# Altium schematic sheet nfc-epd-sensors.SchDoc
size A
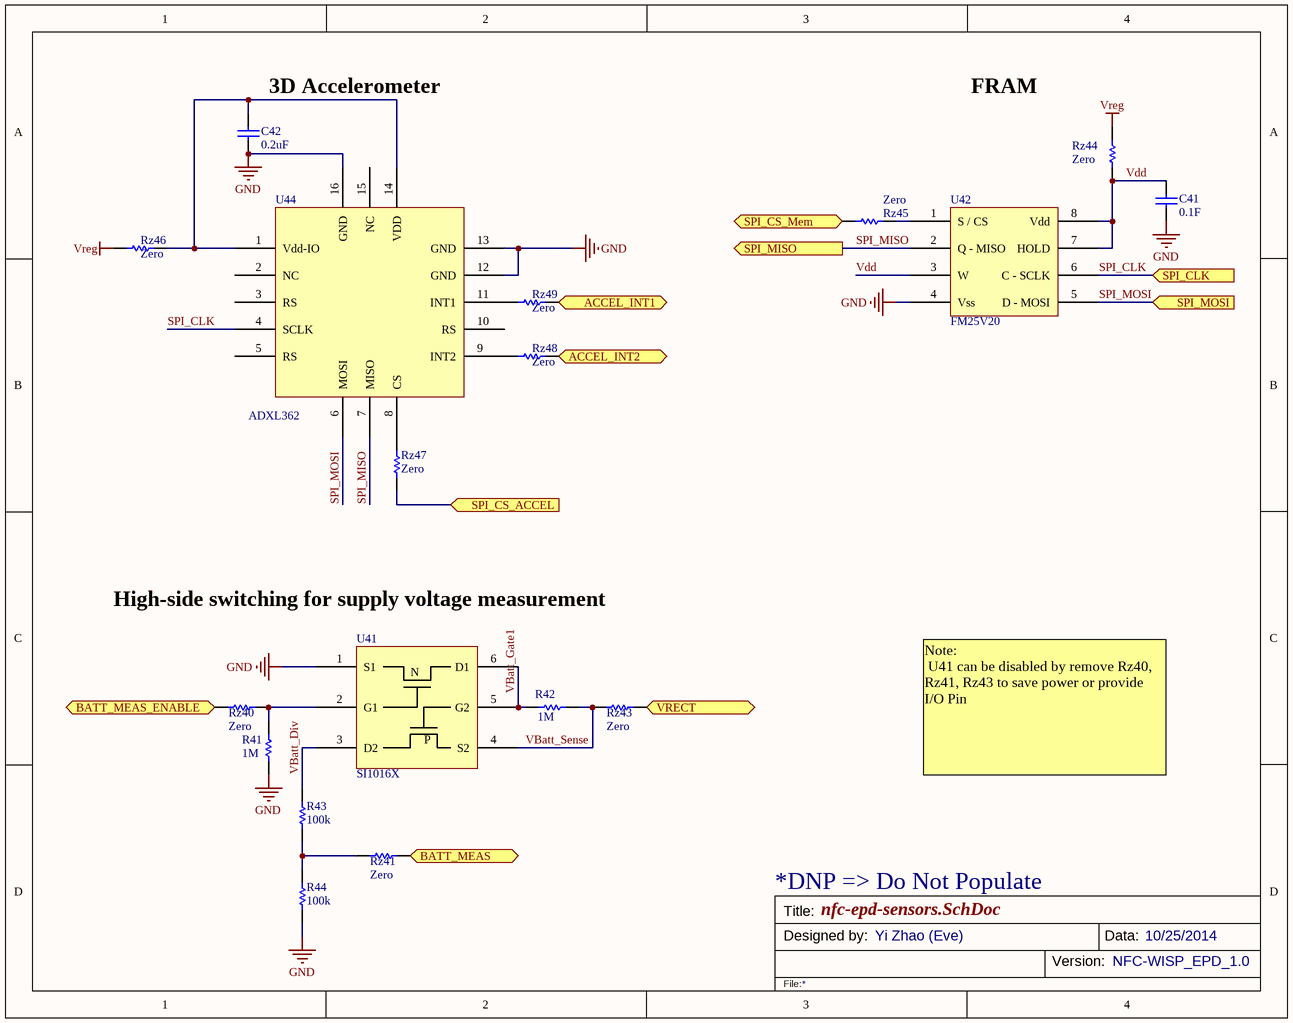
[diagram p0: nfc-epd-sensors.SchDoc]

## Parts
C41  value 0.1F  [0603]  (hidden comment: Cap)
C42  value 0.2uF  [0402]  (hidden comment: Cap)
R41  value 1M  [0603]  (hidden comment: Res)
R42  value 1M  [0603]  (hidden comment: Res)
R43  value 100k  [0603]  (hidden comment: Res)
R44  value 100k  [0603]  (hidden comment: Res)
Rz40  value Zero  [0603]  (hidden comment: Res)
Rz41  value Zero  [0603]  (hidden comment: Res)
Rz43  value Zero  [0603]  (hidden comment: Res)
Rz44  value Zero  [0603]  (hidden comment: Res)
Rz45  value Zero  [0603]  (hidden comment: Res)
Rz46  value Zero  [0603]  (hidden comment: Res)
Rz47  value Zero  [0603]  (hidden comment: Res)
Rz48  value Zero  [0603]  (hidden comment: Res)
Rz49  value Zero  [0603]  (hidden comment: Res)
U41  SI1016X  [SC-89-6 Vishay]
U42  FM25V20  [TDFN-8]
U44  ADXL362  [ADXL362 - Mod 6mil clearence]

## Ports
ACCEL_INT1 (out), ACCEL_INT2 (out), BATT_MEAS (out), BATT_MEAS_ENABLE (in), SPI_CLK (in), SPI_CS_ACCEL (in), SPI_CS_Mem (in), SPI_MISO (out), SPI_MOSI (in), VRECT (in)

## Nets
GND: C41.1 C42.2 R41.1 R44.1 U41.1(S1) U42.4(Vss) U44.12(GND) U44.13(GND) U44.16(GND)
Vreg: Rz44.1 Rz46.1
ACCEL_INT1: Rz49.2 ; port ACCEL_INT1
ACCEL_INT2: Rz48.2 ; port ACCEL_INT2
BATT_MEAS: Rz41.1 ; port BATT_MEAS
BATT_MEAS_ENABLE: Rz40.2 ; port BATT_MEAS_ENABLE
SPI_CLK: U42.6(C_-_SCLK) U44.4(SCLK) ; port SPI_CLK
SPI_CS_ACCEL: Rz47.1 ; port SPI_CS_ACCEL
SPI_CS_Mem: Rz45.1 ; port SPI_CS_Mem
SPI_MISO: U42.2(Q_-_MISO) U44.7(MISO) ; port SPI_MISO
SPI_MOSI: U42.5(D_-_MOSI) U44.6(MOSI) ; port SPI_MOSI
VBatt_Div: R43.2 U41.3(D2)
VBatt_Gate1: R42.2 U41.5(G2) U41.6(D1)
VBatt_Sense: R42.1 Rz43.2 U41.4(S2)
Vdd: C41.2 Rz44.2 U42.3(W) U42.7(HOLD) U42.8(Vdd)
VRECT: Rz43.1 ; port VRECT
NetC42_1: C42.1 Rz46.2 U44.1(Vdd-IO) U44.14(VDD)
NetR41_2: R41.2 Rz40.1 U41.2(G1)
NetR43_1: R43.1 R44.2 Rz41.2
NetRz45_2: Rz45.2 U42.1(S_/_CS)
NetRz47_2: Rz47.2 U44.8(CS)
NetRz48_1: Rz48.1 U44.9(INT2)
NetRz49_1: Rz49.1 U44.11(INT1)

Not connected (* = marked no-connect by the designer): U44 2(NC) 3(RS) 5(RS) 10(RS) 15(NC)

## Notes on the sheet
- (near C42) 3D Accelerometer
- FRAM
- High-side switching for supply voltage measurement
- Note:
  U41 can be disabled by remove Rz40, Rz41, Rz43 to save power or provide I/O Pin
- *DNP => Do Not Populate
- Title:
- Designed by:
- Yi Zhao (Eve)
- Version:
- Data:
- NFC-WISP_EPD_1.0
- 10/25/2014
- File:
- (in symbol SI1016X) N; P

## Library data of the parts
C41 C42 = Cap: Ceramic Capacitor (Surface Mount); Manufacturer: Generic Ceramic Chip Cap (TBD); Digi-Key Part Number: *; Manufacturer Part Number: *; Note: *; Rating: *
R41-R44 = Res: Chip Resistor (Surface Mount); Manufacturer: Generic Chip Res (TBD); Manufacturer Part Number: *; Digi-Key Part Number: *; Rating: *; Note: *
Rz40 Rz41 Rz43-Rz49 = Res: Chip Resistor (Surface Mount); Manufacturer: Generic Chip Res (TBD); Manufacturer Part Number: RC0603FR-070RL; Note: DNP; Digi-Key Part Number: *; Rating: *; Supplier 1: Digi-Key; Supplier Part Number 1: 311-0.0HRCT-ND
U41 = SI1016X: NMOS and PMOS array; Manufacturer: Vishay Siliconix; Manufacturer Part Number: SI1016X-T1-GE3; Digi-Key Part Number: SI1016X-T1-GE3CT-ND; Note: *; Value: *; Rating: *; Supplier 1: Digi-Key; Supplier Part Number 1: SI1016X-T1-GE3CT-ND
U42 = FM25V20: ? Mbit FRAM SPI; Manufacturer: Cypress Semiconductor Corp; Digi-Key Part Number: 428-3214-ND; Manufacturer Part Number: FM25V20; Rating: *; Note: *; Supplier 1: Digi-Key
U44 = ADXL362: 3D ACCEL DIG LO PWR 16LGA; Manufacturer: Analog Devices Inc; Manufacturer Part Number: ADXL362BCCZ-R2; Digi-Key Part Number: ADXL362BCCZ-R2CT-ND; Value: *; Rating: *; Note: *; Supplier 1: Digi-Key; Supplier Part Number 1: ADXL362BCCZ-R2CT-ND